# EasyEDA Pro project BULLBERRYCPP_REV1.0_2025-06-09.epro

# Schematic Schematic1
Board Name: Board1; Create Date: 2025-05-03; Page Name: P1; Project Name: STM32_RA02; Schematic Name: Schematic1; Update Date: 2025-06-09; Company: EasyEDA.com; Page Size: A4; Version: V1.0
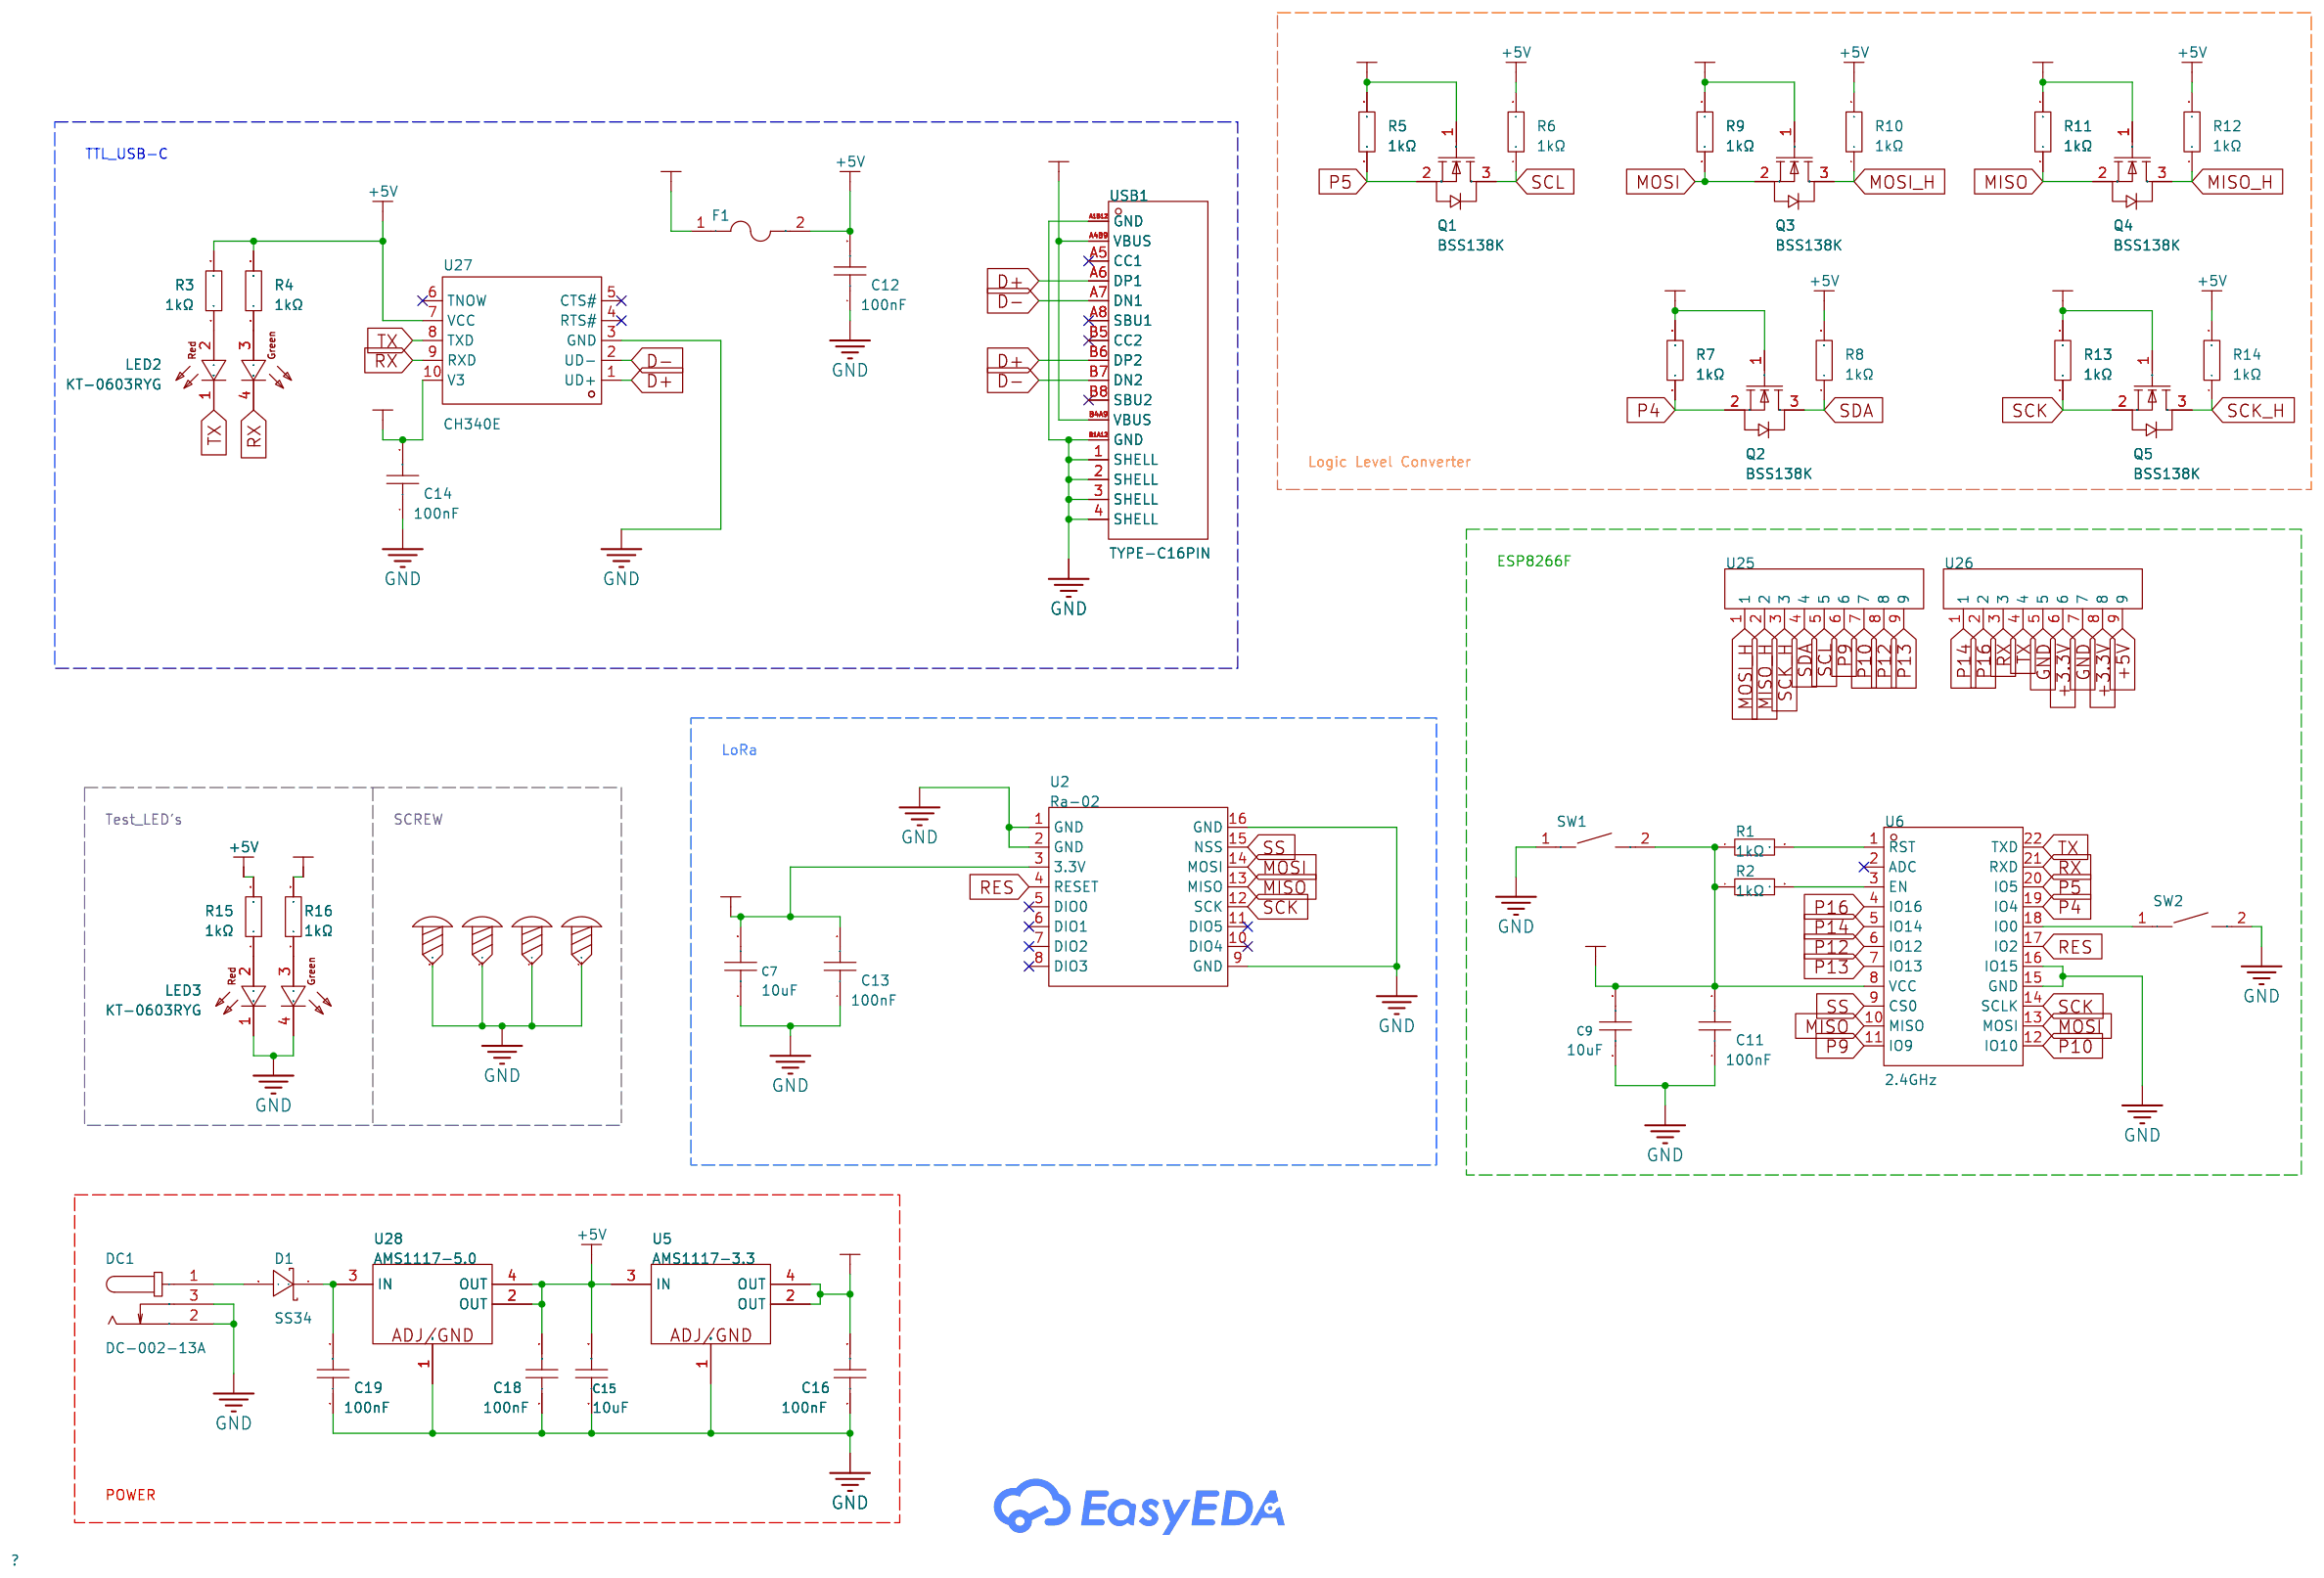
[diagram p0: schematic sheet]

## Parts
C7  10uF  [C0603]
C9  10uF  [C0603]
C11  100nF  [C0603]
C12  100nF  [C0603]
C13  100nF  [C0603]
C14  100nF  [C0603]
C15  10uF  [C0603]
C16  100nF  [C0603]
C18  100nF  [C0603]
C19  100nF  [C0603]
D1  SS34  [SMA_L4.3-W2.6-LS5.2-RD]
DC1  DC-002-13A  [DC-IN-TH_DC-002-13A]
F1  JFC0603-0500FS  [F0603]
LED2  KT-0603RYG  [LED-SMD_4P-L1.6-W1.5_KT-0603RG]
LED3  KT-0603RYG  [LED-SMD_4P-L1.6-W1.5_KT-0603RG]
Q1  BSS138K  [SOT-23-3_L2.9-W1.3-P0.95-LS2.4-BR]
Q2  BSS138K  [SOT-23-3_L2.9-W1.3-P0.95-LS2.4-BR]
Q3  BSS138K  [SOT-23-3_L2.9-W1.3-P0.95-LS2.4-BR]
Q4  BSS138K  [SOT-23-3_L2.9-W1.3-P0.95-LS2.4-BR]
Q5  BSS138K  [SOT-23-3_L2.9-W1.3-P0.95-LS2.4-BR]
R1  1kΩ  [R0603]
R2  1kΩ  [R0603]
R3  1kΩ  [R0603]
R4  1kΩ  [R0603]
R5  1kΩ  [R0603]
R6  1kΩ  [R0603]
R7  1kΩ  [R0603]
R8  1kΩ  [R0603]
R9  1kΩ  [R0603]
R10  1kΩ  [R0603]
R11  1kΩ  [R0603]
R12  1kΩ  [R0603]
R13  1kΩ  [R0603]
R14  1kΩ  [R0603]
R15  1kΩ  [R0603]
R16  1kΩ  [R0603]
SCREW1  -  [Screw-Hole-M2]
SCREW2  -  [Screw-Hole-M2]
SCREW3  -  [Screw-Hole-M2]
SCREW4  -  [Screw-Hole-M2]
SW1  TS-1088-AR02016  [SW-SMD_L3.9-W3.0-P4.45]
SW2  TS-1088-AR02016  [SW-SMD_L3.9-W3.0-P4.45]
U2  Ra-02  [WIRELM-SMD_RA-02-BL]
U5  AMS1117-3.3  [SOT-223-3_L6.4-W3.5-P2.30-LS7.0-BR]
U6  2.4GHz  [WIRELM-SMD_ESP-12F]
U25  DIP插件  [HDR-TH_9P-P2.00-V-F]
U26  DIP插件  [HDR-TH_9P-P2.00-V-F]
U27  CH340E  [MSOP-10_L3.0-W3.0-P0.50-LS5.0-BL]
U28  AMS1117-5.0  [SOT-223-3_L6.4-W3.5-P2.30-LS7.0-BR]
USB1  TYPE-C16PIN  [USB-C-SMD_TYPE-C16PIN]

## Library data of the parts
C7 C9 C15 = CL10A106MA8NRNC: Capacitance: Tolerance:±20% Tolerance:±20% Voltage Rated: Temperature Coefficient:; LCSC Part Name: 10uF ±20% 25V; Supplier Part: C96446; Manufacturer: SAMSUNG(三星); Supplier Footprint: 0603; Datasheet: https://atta.szlcsc.com/upload/public/pdf/source/20160218/1457707763339.pdf; Supplier: LCSC; Tolerance: ±20%
C11-C14 C16 C18 C19 = CC0603KRX7R9BB104: Capacitance:100nF Tolerance:±10% Tolerance:±10% Voltage Rating:50V Temperature Coefficient:X7R; LCSC Part Name: 100nF ±10% 50V; Supplier Part: C14663; Manufacturer: YAGEO(国巨); Supplier Footprint: 0603; JLCPCB Part Class: Basic Part; Datasheet: https://atta.szlcsc.com/upload/public/pdf/source/20180910/C282072_33301C7F631E79921B82A8DAC6BCC5B3.pdf; Supplier: LCSC; Tolerance: ±10%; Voltage Rating: 50V; Temperature Coefficient: X7R
D1 = SS34_C8678: Diode Configuration:Independent Type Forward Voltage (Vf@If):550mV@3A Reverse Voltage (Vr):40V Rectified Current:3A Reverse Leakage Current (Ir):500uA@40V; LCSC Part Name: 电压:40V 电流:3A; Supplier Part: C8678; Manufacturer: MDD(辰达半导体); Supplier Footprint: SMA(DO-214AC); JLCPCB Part Class: Basic Part; Datasheet: https://atta.szlcsc.com/upload/public/pdf/source/20240710/2118BB86FDDB2E0B294389AC1F3F65C8.pdf; Supplier: LCSC; Diode Configuration: Independent Type; Forward Voltage (Vf@If): 550mV@3A; Reverse Voltage (Vr): 40V; Rectified Current: 3A; Reverse Leakage Current (Ir): 500uA@40V
DC1 = DC-002-13A: Connector Type:DC Power Receptacle Mounting Style:Bend insert Inside Contact Diameter:1.3mm Outside Contact Diameter:4.2mm Current Rating (Max):500mA Voltage Rating (Max):30V Operating Temperature Range:-20℃~+70℃ Operating Temperature Range:-20℃~+70℃; LCSC Part Name: DC电源插座 内径:1.3mm 外径:4.2mm; Supplier Part: C707309; Manufacturer: 韩国韩荣; Supplier Footprint: 插件; JLCPCB Part Class: Extended Part; Datasheet: https://atta.szlcsc.com/upload/public/pdf/source/20210810/214B8B4432BF60379F9A852A170B0BF8.pdf; Supplier: LCSC; Connector Type: DC Power Receptacle; Mounting Style: Bend insert; Inside Contact Diameter: 1.3mm; Outside Contact Diameter: 4.2mm; Current Rating (Max): 500mA; Voltage Rating (Max): 30V; Operating Temperature Range: -20℃~+70℃
F1 = JFC0603-0500FS: Type:SMD Fuse Current Rating:500mA Voltage Rating (AC):- Voltage Rating (DC):32V Operating Temperature:-55℃~+125℃ Operating Temperature:-55℃~+125℃ Interrupt Rating:50A; LCSC Part Name: 贴片式保险丝; Supplier Part: C136327; Manufacturer: JDTfuse(集电通); Supplier Footprint: 0603; JLCPCB Part Class: Extended Part; Datasheet: https://atta.szlcsc.com/upload/public/pdf/source/20230515/811EFBDB78EA9425F730277E38B1B60D.pdf; Supplier: LCSC; Type: SMD Fuse; Current Rating: 500mA; Voltage Rating (DC): 32V; Operating Temperature: -55℃~+125℃; Interrupt Rating: 50A
LED2 LED3 = KT-0603RYG: LCSC Part Name: 0603 红普绿 双色; Supplier Part: C24477; Manufacturer: KENTO; Supplier Footprint: 0603x2; JLCPCB Part Class: Extended Part; Datasheet: https://atta.szlcsc.com/upload/public/pdf/source/20240614/A37E0302B47AC53F7ED7BF75B5175F81.pdf; Supplier: LCSC
Q1-Q5 = BSS138K_C18221542: Type:1 N-channel Drain to Source Voltage:50V Current - Continuous Drain(Id):- RDS(on):1.2Ω@10V,0.2A Pd - Power Dissipation:- Gate Threshold Voltage (Vgs(th)@Id):800mV Gate Charge(Qg):- Input Capacitance(Ciss@Vds):25.5pF@30V Reverse Transfer Capacitance (C; LCSC Part Name: 1个N沟道 耐压:50V 电流:500mA; Supplier Part: C18221542; Manufacturer: PAKER(派克微); Supplier Footprint: SOT-23; JLCPCB Part Class: Extended Part; Datasheet: https://atta.szlcsc.com/upload/public/pdf/source/20231012/5B919D1E52D9D928AB3BBCE981CA3146.pdf; Supplier: LCSC; Type: 1 N-channel; Drain to Source Voltage: 50V; RDS(on): 1.2Ω@10V,0.2A; Gate Threshold Voltage (Vgs(th)@Id): 800mV; Input Capacitance(Ciss@Vds): 25.5pF@30V; Operating Temperature: -55℃~+150℃
R1-R16 = 0603WAF1001T5E: Type:Thick Film Resistors Resistance:1kΩ Tolerance:±1% Tolerance:±1% Power(Watts): Overload Voltage (Max): Temperature Coefficient:±100ppm/℃ Temperature Coefficient:±100ppm/℃ Operating Temperature Range:-55℃~+155℃ Operating Temperature Range:-55℃~+155℃; LCSC Part Name: 1kΩ ±1% 100mW 厚膜电阻; Supplier Part: C21190; Manufacturer: UNI-ROYAL(厚声); Supplier Footprint: 0603; Datasheet: https://atta.szlcsc.com/upload/public/pdf/source/20200306/C422600_1E6D84923E4A46A82E41ADD87F860B5C.pdf; Supplier: LCSC; Type: Thick Film Resistors; Tolerance: ±1%; Temperature Coefficient: ±100ppm/℃; Operating Temperature Range: -55℃~+155℃
SCREW1-SCREW4 = Screw-Hole-M2: Supplier Footprint: 插件
SW1 SW2 = TS-1088-AR02016: Circuit:SPST Actuator Style:Round Button Operating Force:160gf Mounting Style:Brick nogging Switch Length:4mm Switch Width:3mm Switch Height:2mm Strike Gundam:不带 Contact Current:50mA Voltage Rating (DC):12V Insulation Resistance:100MΩ Actuator/Cap Color:B; LCSC Part Name: 4*3*2mm 立贴 轻触开关; Supplier Part: C720477; Manufacturer: XUNPU(讯普); Supplier Footprint: SMD; JLCPCB Part Class: Basic Part; Datasheet: https://atta.szlcsc.com/upload/public/pdf/source/20200810/C720475_60D09DD6C54279ADDB2DC25100F1CC11.pdf; Supplier: LCSC; Circuit: SPST; Actuator Style: Round Button; Operating Force: 160gf; Mounting Style: Brick nogging; Switch Length: 4mm; Switch Width: 3mm; Switch Height: 2mm; Strike Gundam: 不带; Contact Current: 50mA; Voltage Rating (DC): 12V; Insulation Resistance: 100MΩ; Actuator/Cap Color: Black; Pin Style: SMDSplicing; Mechanical Life: 10万次; Operating Temperature: -30℃~+80℃
U2 = Ra-02_C90039: Output Power:20dBm Output Power:20dBm Support Interface:SPI Modulation System:LoRa；OOK；MSK；GFSK；FSK；GMSK Operating Voltage:3.3V Operating Voltage:3.3V Antenna Type:IPEX Interface Receive  Current:12.15mA Send  Current:105mA Sensitivity:-140dBm Sensitivity; LCSC Part Name: 433MHz LORA扩频无线模块 超远10KM SX1278; Supplier Part: C90039; Manufacturer: Ai-Thinker(安信可); Supplier Footprint: SMD-16P; Datasheet: https://atta.szlcsc.com/upload/public/pdf/source/20181018/C90039_B5D7ADB38ADA1100C85850A55553934D.pdf; Supplier: LCSC; Output Power: 20dBm; Support Interface: SPI; Modulation System: LoRa；OOK；MSK；GFSK；FSK；GMSK; Operating Voltage: 3.3V; Antenna Type: IPEX Interface; Receive  Current: 12.15mA; Send  Current: 105mA; Sensitivity: -140dBm; Operating Temperature: -40℃~+85℃
U5 = AMS1117-3.3: Output Type:Fixed Voltage - Supply:15V Output Voltage:3.3V Output Voltage:3.3V Output Current:1A Power Supply Rejection Ratio (PSRR):- Features:Overcurrent Protection(OCP) Operating Temperature:-40℃~+125℃ Operating Temperature:-40℃~+125℃ Output Configurat; Supplier Part: C2992570; Manufacturer: 国芯佳品; Supplier Footprint: SOT-223-3; JLCPCB Part Class: Extended Part; Datasheet: https://atta.szlcsc.com/upload/public/pdf/source/20220729/0D21C21EC310E4778671BF6BAE438640.pdf; Supplier: LCSC; Output Type: Fixed; Voltage - Supply: 15V; Output Voltage: 3.3V; Output Current: 1A; Features: Overcurrent Protection(OCP); Operating Temperature: -40℃~+125℃; Output Configuration: Positive electrode; Number of Outputs: 1
U6 = ESP-12F: Wireless Standard:WIFI4 Interface Type:IO；UART Frequency:2.4GHz Antenna Type:PCB Output Power:15dBm Output Power:15dBm Voltage - Supply:3.3V Voltage - Supply:3.3V Receive  Current:55mA Send  Current:375mA Sensitivity:-96dBm Sensitivity:-96dBm Operating Te; LCSC Part Name: ESP8266 WiFi模组,32Mbit Flash, 通用模组; Supplier Part: C19949064; Manufacturer: DOIT(四博智联); Supplier Footprint: SMD,24x16mm; JLCPCB Part Class: Extended Part; Datasheet: https://atta.szlcsc.com/upload/public/pdf/source/20240112/4C731B83AC84B82D8ABE33233BB0FED4.pdf; Supplier: LCSC; Wireless Standard: WIFI4; Interface Type: IO；UART; Antenna Type: PCB; Output Power: 15dBm; Voltage - Supply: 3.3V; Receive  Current: 55mA; Send  Current: 375mA; Sensitivity: -96dBm; Operating Temperature: -40℃~+85℃
U25 U26 = DIP插件: Supplier Part: C9900022440; Supplier Footprint: HDR-TH-6P; JLCPCB Part Class: Extended Part; Supplier: LCSC
U27 = CH340E: Applications Function:Transceiver Protocol: Supply Voltage:3.3V；5V Supply Voltage:3.3V；5V Data Rate:2Mbps; LCSC Part Name: USB转串口芯片CH340; Supplier Part: C99652; Manufacturer: WCH(南京沁恒); Supplier Footprint: MSOP-10; Datasheet: https://atta.szlcsc.com/upload/public/pdf/source/20240313/4FD4567B6A986AE079C4960D6CEBDDB5.pdf; Supplier: LCSC; Applications Function: Transceiver; Supply Voltage: 3.3V；5V; Data Rate: 2Mbps
U28 = AMS1117-5.0: Output Type:Fixed Voltage - Supply:15V Output Voltage:5V Output Voltage:5V Output Current:1A Power Supply Rejection Ratio (PSRR):- Features:Overcurrent Protection(OCP) Operating Temperature:-40℃~+125℃ Operating Temperature:-40℃~+125℃ Output Configuration:; Supplier Part: C2992571; Manufacturer: 国芯佳品; Supplier Footprint: SOT-223-3; JLCPCB Part Class: Extended Part; Datasheet: https://atta.szlcsc.com/upload/public/pdf/source/20220729/0D21C21EC310E4778671BF6BAE438640.pdf; Supplier: LCSC; Output Type: Fixed; Voltage - Supply: 15V; Output Voltage: 5V; Output Current: 1A; Features: Overcurrent Protection(OCP); Operating Temperature: -40℃~+125℃; Output Configuration: Positive electrode; Number of Outputs: 1
USB1 = TYPE-C16PIN: Connector Type:Type-C Standard:USB 3.1 Gender:Female Mounting Style:Horizontal attachment Number of Contacts:16P Number of Ports:1 Current Rating - Power (Max):3A Operating Temperature Range:-40℃~+85℃ Operating Temperature Range:-40℃~+85℃ Rated Voltage (M; LCSC Part Name: Type-C 母 卧贴; Supplier Part: C393939; Manufacturer: SHOU HAN(首韩); Supplier Footprint: SMD; Datasheet: https://atta.szlcsc.com/upload/public/pdf/source/20190521/C393939_7B9043D4CF1026AF443AB60D91FBCD5C.pdf; Supplier: LCSC; Connector Type: Type-C; Standard: USB 3.1; Gender: Female; Mounting Style: Horizontal attachment; Number of Contacts: 16P; Number of Ports: 1; Current Rating - Power (Max): 3A; Operating Temperature Range: -40℃~+85℃; Rated Voltage (Max): 30V; Connect-Disconnect Life: 10,000 times; Core Colour: Black

## Nets
+3.3V: C7.2 C9.2 C11.2 C13.2 C14.2 C16.2 Q1.1(G) Q2.1(G) Q3.1(G) Q4.1(G) Q5.1(G) R1.1 R2.1 R5.2 R7.2 R9.2 R11.2 R13.2 R16.2 SW1.2 U2.3(3.3V) U5.2(OUT) U5.4(OUT) U6.8(VCC) U26.6 U26.8 U27.10(V3)
+5V: C12.2 C15.2 C18.2 F1.2 R3.2 R4.2 R6.2 R8.2 R10.2 R12.2 R14.2 R15.2 U5.3(IN) U26.9 U27.7(VCC) U28.2(OUT) U28.4(OUT)
GND: C7.1 C9.1 C11.1 C12.1 C13.1 C14.1 C15.1 C16.1 C18.1 C19.1 DC1.2 DC1.3 LED3.1(C) LED3.4(C) SCREW1.1 SCREW2.1 SCREW3.1 SCREW4.1 SW1.1 SW2.2 U2.1(GND) U2.2(GND) U2.9(GND) U2.16(GND) U5.1(ADJ/GND) U6.15(GND) U6.16(IO15) U26.5 U26.7 U27.3(GND) U28.1(ADJ/GND) USB1.1(SHELL) USB1.2(SHELL) USB1.3(SHELL) USB1.4(SHELL) USB1.A1B12(GND) USB1.B1A12(GND)
VBUS: F1.1 USB1.A4B9(VBUS) USB1.B4A9(VBUS)
D+: U27.1(UD+) USB1.A6(DP1) USB1.B6(DP2)
D-: U27.2(UD-) USB1.A7(DN1) USB1.B7(DN2)
MISO: Q4.2(S) R11.1 U2.13(MISO) U6.10(MISO)
MISO_H: Q4.3(D) R12.1 U25.2
MOSI: Q3.2(S) R9.1 U2.14(MOSI) U6.13(MOSI)
MOSI_H: Q3.3(D) R10.1 U25.1
P4: Q2.2(S) R7.1 U6.19(IO4)
P5: Q1.2(S) R5.1 U6.20(IO5)
P9: U6.11(IO9) U25.6
P10: U6.12(IO10) U25.7
P12: U6.6(IO12) U25.8
P13: U6.7(IO13) U25.9
P14: U6.5(IO14) U26.1
P16: U6.4(IO16) U26.2
RES: U2.4(RESET) U6.17(IO2)
RX: LED2.4(C) U6.21(RXD) U26.3 U27.9(RXD)
SCK: Q5.2(S) R13.1 U2.12(SCK) U6.14(SCLK)
SCK_H: Q5.3(D) R14.1 U25.3
SCL: Q1.3(D) R6.1 U25.5
SDA: Q2.3(D) R8.1 U25.4
SS: U2.15(NSS) U6.9(CS0)
TX: LED2.1(C) U6.22(TXD) U26.4 U27.8(TXD)
$1N5142: R2.2 U6.3(EN)
$1N5147: R1.2 U6.1(RST)
$1N5632: SW2.1 U6.18(IO0)
$1N9518: LED2.2(A) R3.1
$1N9520: LED2.3(A) R4.1
$1N11147: C19.2 D1.1(K) U28.3(IN)
$1N12736: LED3.2(A) R15.1
$1N12778: LED3.3(A) R16.1
$1N14428: D1.2(A) DC1.1

Not connected (* = marked no-connect by the designer): U2 5(DIO0)* 6(DIO1)* 7(DIO2)* 8(DIO3)* 10(DIO4)* 11(DIO5)*; U6 2(ADC)*; U27 4(RTS#)* 5(CTS#)* 6(TNOW)*; USB1 A5(CC1)* A8(SBU1)* B5(CC2)* B8(SBU2)*

## Notes on the sheet
- TTL_USB-C
- Logic Level Converter
- ESP8266F
- LoRa
- Test_LED's
- SCREW
- POWER

# Board PCB1
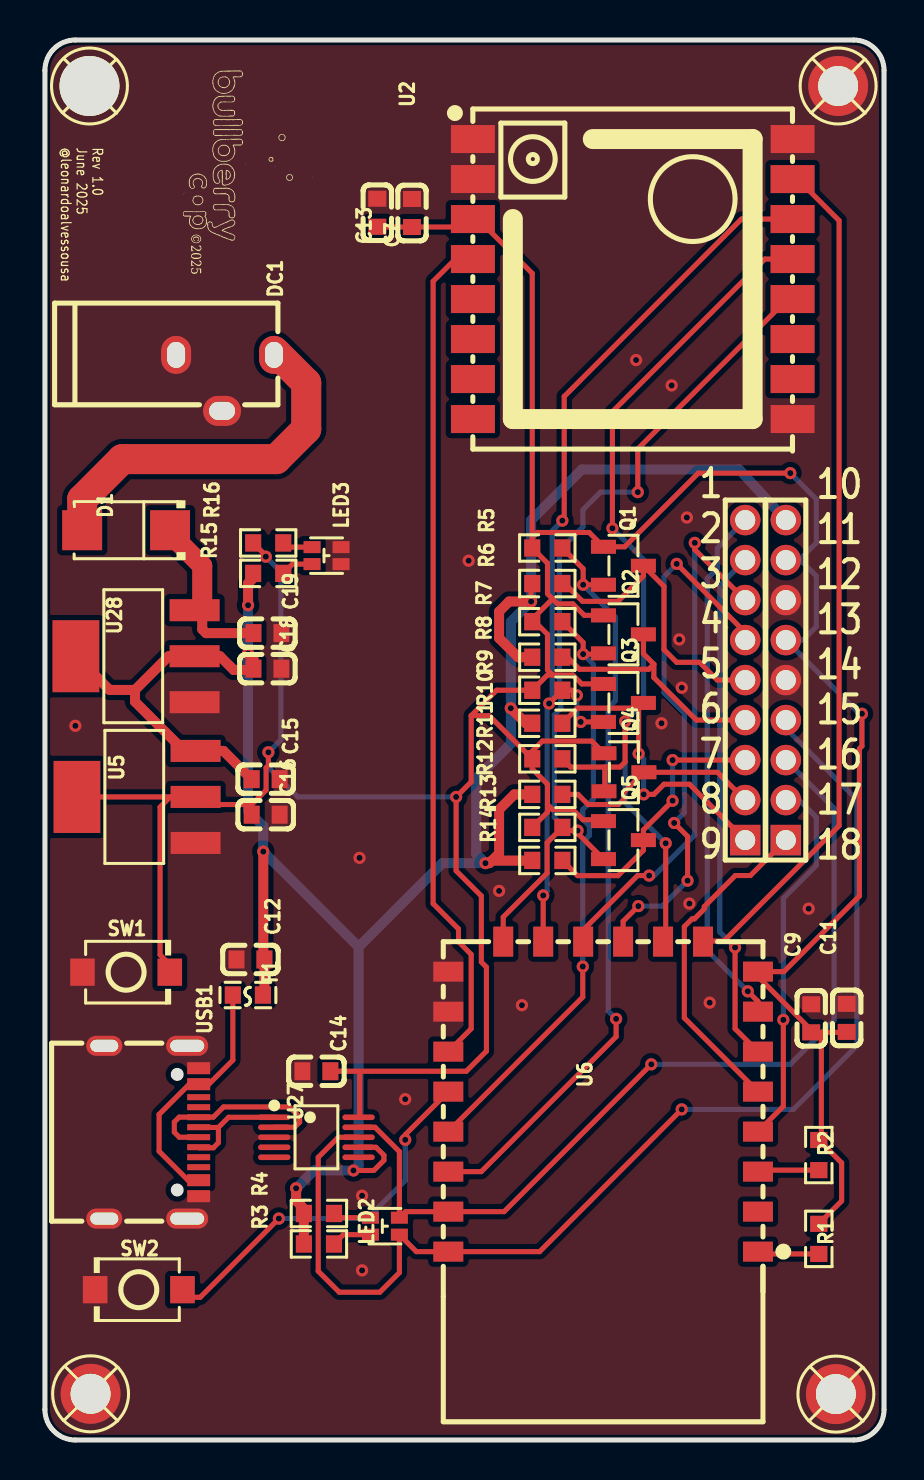
[diagram p1: board, top side]
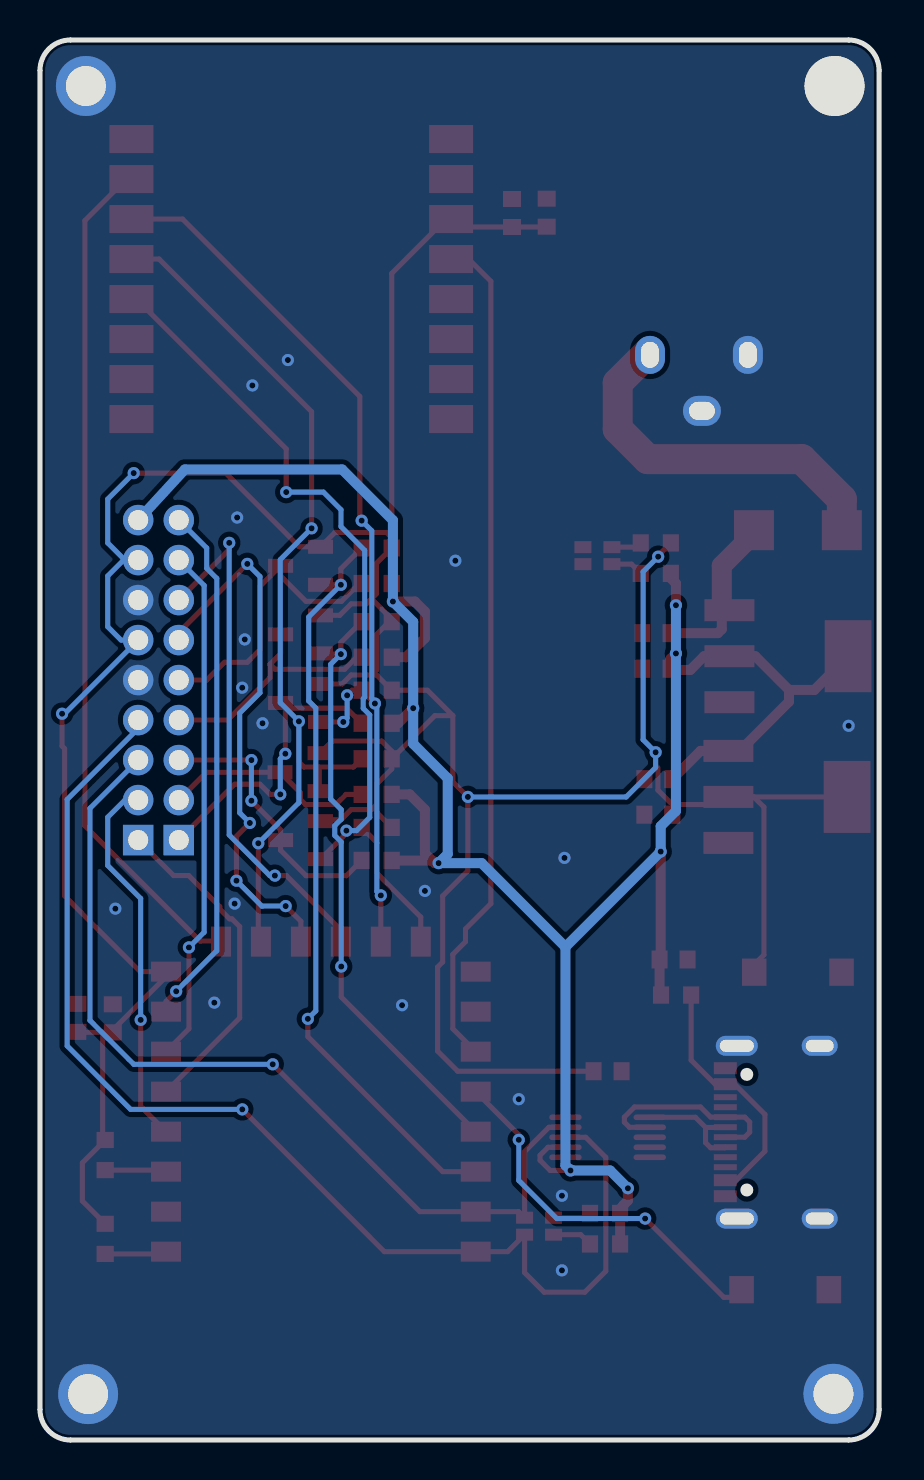
[diagram p2: board, bottom side, seen from below]

Outline 42 x 70 mm; copper layers: Top Layer, Bottom Layer. Coordinates in mm from the lower left corner of the outline.
Outline path: 0,68.48 0,1.52 arc(0.45,0.45) 1.52,0 40.48,0 arc(41.55,0.45) 42,1.52 42,68.48 arc(41.55,69.55) 40.48,70 1.52,70 arc(0.45,69.55) 0,68.48
Stack: Top Layer 0.035mm / Dielectric1 1.51mm FR4 er 4.5 / Bottom Layer 0.035mm

## Design rules (mm)
template: JLCPCB Capability(Two Layers Board)
spacing copperThickness1oz (default): track to track 0.102, other pairs 0.152 to 0.3
spacing copperThickness2oz: track to track 0.203, other pairs 0.152 to 0.3
track width copperThickness1oz (default): min 0.127, default 0.254, max 2.54
track width copperThickness2oz: min 0.203, default 0.254, max 2.54
differential pair differentialPair (default): width min 0.127, default 0.254, max 2.54; gap min 0.152, default 0.152
via viaSize (default): diameter min 0.5, default 0.61, max 10; hole min 0.3, default 0.305, max 6.3

## Placement (name value [footprint] x y rotation side)
C7  10uF  [C0603]  18.37 61.35 270 top
C9  10uF  [C0603]  38.36 21.08 270 top
C11  100nF  [C0603]  40.13 21.11 270 top
C12  100nF  [C0603]  10.29 24.03 0 top
C13  100nF  [C0603]  16.64 61.36 270 top
C14  100nF  [C0603]  13.59 18.44 0 top
C15  10uF  [C0603]  11.05 33.04 180 top
C16  100nF  [C0603]  11.05 31.27 180 top
C18  100nF  [C0603]  11.14 38.57 180 top
C19  100nF  [C0603]  11.14 40.34 180 top
D1  SS34  [SMA_L4.3-W2.6-LS5.2-RD]  4.06 45.49 180 top
DC1  DC-002-13A  [DC-IN-TH_DC-002-13A]  9.02 52.86 0 top
F1  JFC0603-0500FS  [F0603]  10.16 22.25 0 top
LED2  KT-0603RYG  [LED-SMD_4P-L1.6-W1.5_KT-0603RG]  17.02 10.69 180 top
LED3  KT-0603RYG  [LED-SMD_4P-L1.6-W1.5_KT-0603RG]  14.1 44.22 180 top
Q1  BSS138K  [SOT-23-3_L2.9-W1.3-P0.95-LS2.4-BR]  28.96 43.71 180 top
Q2  BSS138K  [SOT-23-3_L2.9-W1.3-P0.95-LS2.4-BR]  28.96 40.28 180 top
Q3  BSS138K  [SOT-23-3_L2.9-W1.3-P0.95-LS2.4-BR]  28.96 36.85 180 top
Q4  BSS138K  [SOT-23-3_L2.9-W1.3-P0.95-LS2.4-BR]  28.98 33.39 180 top
Q5  BSS138K  [SOT-23-3_L2.9-W1.3-P0.95-LS2.4-BR]  28.96 30 180 top
R1  1kΩ  [R0603]  38.74 10.06 270 top
R2  1kΩ  [R0603]  38.74 14.25 270 top
R3  1kΩ  [R0603]  13.72 9.8 180 top
R4  1kΩ  [R0603]  13.72 11.33 180 top
R5  1kΩ  [R0603]  25.15 44.6 180 top
R6  1kΩ  [R0603]  25.15 42.82 180 top
R7  1kΩ  [R0603]  25.15 40.92 180 top
R8  1kΩ  [R0603]  25.15 39.14 180 top
R9  1kΩ  [R0603]  25.15 37.49 180 top
R10  1kΩ  [R0603]  25.15 35.84 180 top
R11  1kΩ  [R0603]  25.15 34.06 180 top
R12  1kΩ  [R0603]  25.15 32.28 180 top
R13  1kΩ  [R0603]  25.15 30.63 180 top
R14  1kΩ  [R0603]  25.15 28.98 180 top
R15  1kΩ  [R0603]  11.18 43.33 180 top
R16  1kΩ  [R0603]  11.18 44.85 180 top
SCREW1  -  [Screw-Hole-M2#2]  2.23 67.7 0 top
SCREW2  -  [Screw-Hole-M2]  39.7 67.7 0 top
SCREW3  -  [Screw-Hole-M2]  2.29 2.31 0 top
SCREW4  -  [Screw-Hole-M2]  39.59 2.29 0 top
SW1  TS-1088-AR02016  [SW-SMD_L3.9-W3.0-P4.45]  4.06 23.39 0 top
SW2  TS-1088-AR02016  [SW-SMD_L3.9-W3.0-P4.45]  4.7 7.52 180 top
U2  Ra-02  [WIRELM-SMD_RA-02-BL]  29.42 58.05 270 top
U5  AMS1117-3.3  [SOT-223-3_L6.4-W3.5-P2.30-LS7.0-BR]  4.57 32.15 0 top
U6  2.4GHz  [WIRELM-SMD_ESP-12F]  27.94 17.17 180 top
U25  DIP插件  [HDR-TH_9P-P2.00-V-F]  35.05 38 90 top
U26  DIP插件  [HDR-TH_9P-P2.00-V-F]  37.08 38 90 top
U27  CH340E  [MSOP-10_L3.0-W3.0-P0.50-LS5.0-BL]  13.59 15.14 270 top
U28  AMS1117-5.0  [SOT-223-3_L6.4-W3.5-P2.30-LS7.0-BR]  4.52 39.19 0 top
USB1  TYPE-C16PIN  [USB-C-SMD_TYPE-C16PIN]  5.33 15.39 270 top

## Footprints (pads in the part's own frame, mm; a bottom-side part is the same pattern mirrored in y, then rotated)
C0603
  rect 0.8x0.9 smd: 1(-0.7,0) 2(0.7,0)
DC-IN-TH_DC-002-13A
  oval 1.5x1.9 hole 0.9x1.3: 1(2.45,1.4) 2(-2.45,1.4)
  oval 1.9x1.5 hole 1.3x0.9: 3(-0.15,-1.4)
F0603
  rect 0.806x0.864 smd: 1(-0.753,0) 2(0.753,0)
HDR-TH_9P-P2.00-V-F
  rect 1.524x1.524 hole 1: 1(-8,0)
  round 1.524 hole 1: 2(-6,0) 3(-4,0) 4(-2,0) 5(0,0) 6(2,0) 7(4,0) 8(6,0) 9(8,0)
LED-SMD_4P-L1.6-W1.5_KT-0603RG
  rect 0.85x0.6 smd: 1(-0.725,0.425) 2(0.725,0.425) 3(0.725,-0.425) 4(-0.725,-0.425)
MSOP-10_L3.0-W3.0-P0.50-LS5.0-BL
  oval 0.28x1.62 smd: 1(-1,-2.11) 2(-0.5,-2.11) 3(0,-2.11) 4(0.5,-2.11) 5(1,-2.11) 6(1,2.11) 7(0.5,2.11) 8(0,2.11) 9(-0.5,2.11) 10(-1,2.11)
R0603
  rect 0.806x0.864 smd: 1(-0.753,0) 2(0.753,0)
Screw-Hole-M2
  round 3 hole 2: 1(0,0)
Screw-Hole-M2#2
  round 3 hole 6x2: 1(0,0)
SMA_L4.3-W2.6-LS5.2-RD
  rect 2x2 smd: 1(-2.2,0) 2(2.2,0)
SOT-23-3_L2.9-W1.3-P0.95-LS2.4-BR
  rect 1.25x0.7 smd: 1(1,-0.95) 2(1,0.95) 3(-1,0)
SOT-223-3_L6.4-W3.5-P2.30-LS7.0-BR
  rect 2.5x1.1 smd: 1(2.97,-2.3) 2(2.97,0) 3(2.97,2.3)
  rect 2.34x3.6 smd: 4(-2.97,0)
SW-SMD_L3.9-W3.0-P4.45
  rect 1.23x1.36 smd: 1(-2.185,0) 2(2.185,0)
USB-C-SMD_TYPE-C16PIN
  oval 1x2.1 hole 0.6x1.7: 1(-4.32,1.788) 2(4.32,1.788)
  oval 1x1.8 hole 0.6x1.4: 3(-4.32,-2.362) 4(4.32,-2.362)
  rect 0.6x1.15 smd: A1B12(-3.2,2.362) A4B9(-2.4,2.362) B1A12(3.2,2.362) B4A9(2.4,2.362)
  rect 0.3x1.15 smd: A5(-1.25,2.362) A6(-0.25,2.362) A7(0.25,2.362) A8(1.25,2.362) B5(1.75,2.362) B6(0.75,2.362) B7(-0.75,2.362) B8(-1.75,2.362)
WIRELM-SMD_ESP-12F
  rect 1.5x1 smd: 1(-7.75,7.75) 2(-7.75,5.75) 3(-7.75,3.75) 4(-7.75,1.75) 5(-7.75,-0.25) 6(-7.75,-2.25) 7(-7.75,-4.25) 8(-7.75,-6.25) 15(7.75,-6.25) 16(7.75,-4.25) 17(7.75,-2.25) 18(7.75,-0.25) 19(7.75,1.75) 20(7.75,3.75) 21(7.75,5.75) 22(7.75,7.75)
  rect 1x1.5 smd: 9(-5,-7.75) 10(-3,-7.75) 11(-1,-7.75) 12(1,-7.75) 13(3,-7.75) 14(5,-7.75)
WIRELM-SMD_RA-02-BL
  rect 1.4x2.2 smd: 1(-7,-8) 2(-5,-8) 3(-3,-8) 4(-1,-8) 5(1,-8) 6(3,-8) 7(5,-8) 8(7,-8) 9(7,8) 10(5,8) 11(3,8) 12(1,8) 13(-1,8) 14(-3,8) 15(-4.998,8) 16(-7,8)

## Nets
As in the schematic.

Pads without a net: U2 5 6 7 8 10 11; U6 2; U27 4 5 6; USB1 A5 A8 B5 B8

## Via types
v1: diameter 0.61, hole 0.305, Top Layer to Bottom Layer, 61 vias

## Routing (per net, layer and track width the routed paths; a pad name or vN(x,y) marks a point on that pad's centre or on a via; arc(x,y) is an arc through that point)
+3.3V: length 192.1
  Top Layer w0.254: v1(40.89,36.31) 40.89,34.69 40.77,34.57 40.77,27.2 36.98,23.42 U6.8 35.69,23.16 38.36,20.5 C9.2 38.86,20.38 ; 6.27,32.15 U5.4 ; 6.27,32.15 5.76,31.65 5.76,24.26 6.25,23.77 ; 6.27,32.15 U5.2 7.92,31.77 10.35,31.77 ; 25.15,31.77 25.41,31.52 26.42,31.52 26.93,31.01 27.89,31.01 Q5.1 ; 25.15,31.77 25.15,31.39 R13.2 ; 25.15,31.77 25.15,32.79 24.39,33.55 R11.2 ; 38.86,20.38 40.11,20.38 C11.2 ; 38.86,20.38 38.86,15.13 R2.1 39.88,13.86 39.88,11.95 R1.1 ; v1(11.18,34.39) 11.18,33.72 11.07,33.61 11.07,32.49 10.35,31.77 ; v1(37.31,48.34) 32.7,48.34 29.02,44.66 Q1.1 27.24,45.38 24.65,45.38 24.39,45.12 ; R11.2 24.39,34.44 24.9,34.95 27.37,34.95 Q4.1 ; R11.2 22.23,36.22 21.34,36.22 ; 10.35,31.77 C16.2 ; 24.39,45.12 R5.2 25.15,43.84 25.15,42.31 25.41,42.06 ; 24.39,45.12 24.39,58.33 21.68,61.05 U2.3 21.02,60.65 C7.2 16.65,60.65 C13.2 ; 21.34,36.22 21.34,32.91 v1(20.58,32.15) 20.58,28.46 21.84,27.2 21.84,23.9 22.1,23.64 22.1,19.45 21.09,18.44 15.76,18.44 ; 21.34,36.22 22.61,37.49 R9.2 25.15,38.25 25.41,38.25 ; U27.10 15.76,16.19 15.76,18.44 ; v1(11.06,44.17) 11.06,44.22 R16.2 ; Q2.1 27,41.23 26.42,41.81 25.66,41.81 25.41,42.06 ; 15.76,18.44 14.29,18.44 ; 24.39,41.04 R7.2 ; 24.39,41.04 25.41,42.06 ; 24.39,41.04 25.15,40.28 25.15,38.5 25.41,38.25 ; 25.41,38.25 26.42,38.25 26.87,37.8 Q3.1
  Bottom Layer w0.254: U26.8 37.75,44 ; 37.75,44 38.61,44.85 38.61,47.04 v1(37.31,48.34) ; 37.75,44 37.81,44 38.61,43.2 38.61,40.66 37.94,40 U26.6 40.77,36.31 v1(40.89,36.31) ; v1(20.58,32.15) 12.66,32.15 11.18,33.62 v1(11.18,34.39) 11.81,35.01 11.81,43.41 v1(11.06,44.17)
+5V: length 123.9
  Top Layer w0.254: U27.7 16.57,14.64 16.97,14.24 16.97,13.98 16.46,13.48 v1(15.44,13.48) ; R6.2 24.34,42.76 v1(24.34,41.92)
  Top Layer w0.5: v1(12.57,12.59) 12.57,11.97 12.8,11.75 12.8,11.73 13.08,11.44 ; v1(10.17,41.74) 10.17,42.83 10.42,43.08 ; v1(23.32,36.59) 24.07,35.84 R10.2 ; 22.37,28.97 24.38,28.97 R14.2 ; 22.37,28.97 22.25,28.84 v1(22.05,28.84) ; 22.37,28.97 22.73,29.33 22.73,31.52 23.5,32.28 R12.2 ; C12.2 10.99,22.32 ; R4.2 R3.2 ; U28.4 3.24,37.5 4.51,37.5 ; 4.51,37.5 6.2,39.19 U28.2 8.76,39.19 9.45,38.5 10.11,38.5 ; 4.51,37.5 4.51,36.92 6.97,34.45 8.94,34.45 C15.2 ; v1(10.93,29.42) 10.93,24.08 ; R8.2 23.69,39.14 22.73,40.09 22.73,41.42 23.23,41.92 v1(24.34,41.92) ; v1(10.17,39.33) 10.44,39.06 C18.2
  Bottom Layer w0.5: v1(10.17,41.74) v1(10.17,39.33) 10.17,31.45 10.93,30.69 v1(10.93,29.42) 15.7,24.65 ; 15.7,24.65 19.89,28.84 v1(22.05,28.84) 21.59,29.3 21.59,33.08 23.32,34.81 v1(23.32,36.59) 23.32,40.91 v1(24.34,41.92) 24.34,45.99 26.88,48.53 34.75,48.53 U26.9 ; 15.7,24.65 15.7,13.73 v1(15.44,13.48) 13.46,13.48 v1(12.57,12.59)
GND:
  vias: v1(1.52,35.71) v1(15.75,29.11) v1(15.88,12.22) v1(15.88,8.48) v1(18.03,17.04) v1(21.21,43.97) v1(22.73,27.45) v1(23.88,21.74) v1(29.59,54) v1(30.86,35.84) v1(31.37,52.73) v1(31.75,40.03) v1(31.88,37.61) v1(32.13,46.12) v1(32.26,26.82) v1(33.27,21.87) v1(38.23,26.57)
VBUS: length 12.5
  Top Layer w0.254: F1.1 9.41,18.99 8.2,17.79 USB1.A4B9 7.23,17.79 5.72,16.28 5.72,14.44 7.16,12.99 USB1.B4A9
D+: length 5.9
  Top Layer w0.254: USB1.B6 7.72,14.61 8.43,14.61 8.69,14.87 8.69,15.63 ; 8.69,15.63 7.71,15.63 USB1.A6 ; 8.69,15.63 9.19,16.14 U27.1
D-: length 10.3
  Top Layer w0.254: U27.2 12.5,15.64 12.75,15.89 12.75,16.14 12.24,16.65 8.94,16.65 8.43,16.14 6.72,16.14 6.48,15.9 6.48,15.39 6.73,15.14 USB1.A7
MISO: length 47.3
  Top Layer w0.254: U6.10 31.07,25.05 v1(31.07,29.84) ; v1(28.41,45.59) 28.41,51.42 36.04,59.05 U2.13 ; 28.02,33.65 28.79,33.65 29.04,33.9 v1(29.04,35.93) ; 28.02,33.65 28.02,32.48 Q4.2 ; 28.02,33.65 26.31,33.65 R11.1
  Bottom Layer w0.254: v1(28.41,45.59) 29.97,44.02 29.97,36.86 v1(29.04,35.93) 29.04,31.87 v1(31.07,29.84)
MISO_H: length 10.8
  Top Layer w0.254: U25.2 33.66,33.39 Q4.3 28.97,32.37 28.97,32.03 28.71,31.77 27.19,31.77 26.68,32.28 R12.1
MOSI: length 47.2
  Top Layer w0.254: v1(25.24,36.82) R9.1 26.37,37.49 v1(26.62,37.23) ; v1(24.94,27.23) U6.13 ; U2.14 34.86,61.05 25.99,52.18 25.99,46.06 v1(25.9,45.97) ; v1(26.82,35.9) Q3.2
  Bottom Layer w0.254: v1(26.82,35.9) 26.62,36.1 v1(26.62,37.23) ; 25.14,36.82 25.14,27.43 v1(24.94,27.23) ; 25.14,36.82 v1(25.24,36.82) ; 25.14,36.82 25.39,37.08 25.39,45.46 v1(25.9,45.97)
MOSI_H: length 15.4
  Top Layer w0.254: U25.1 32.26,32.79 30.99,32.79 30.48,32.28 v1(29.97,32.28) ; v1(29.72,34.31) 29.72,36.61 ; 29.72,36.61 29.69,36.59 26.65,36.59 R10.1 ; 29.72,36.61 Q3.3
  Bottom Layer w0.254: v1(29.97,32.28) 29.97,34.06 v1(29.72,34.31)
P4: length 30.4
  Top Layer w0.254: v1(26.92,23.67) 26.92,22.15 U6.19 ; Q2.2 27.92,39.29 v1(26.94,39.29) 26.94,39.88 R7.1
  Bottom Layer w0.254: v1(26.92,23.67) 26.92,29.9 27.25,30.23 27.25,30.71 26.92,31.04 26.92,31.52 27.45,32.04 27.45,38.79 v1(26.94,39.29)
P5: length 38.1
  Top Layer w0.254: U6.20 21.84,13.42 28.59,20.17 v1(28.59,21.06) ; R5.1 26.94,43.56 v1(26.94,42.76) Q1.2
  Bottom Layer w0.254: v1(26.94,42.76) 28.55,41.15 28.55,36.95 28.19,36.6 28.19,21.45 v1(28.59,21.06)
P9: length 27.3
  Top Layer w0.254: U25.6 35.05,40.38 v1(31.62,43.81) ; v1(29.7,26.7) 28.94,25.93 U6.11 ; v1(32.17,27.97) 32.17,30.18 v1(31.5,30.85)
  Bottom Layer w0.254: v1(31.62,43.81) 30.99,43.17 30.99,37.36 32,36.34 32,31.36 v1(31.5,30.85) ; v1(32.17,27.97) 30.9,26.7 v1(29.7,26.7)
P10: length 26.6
  Top Layer w0.254: U25.7 32.53,44.52 v1(32.53,44.86) ; U6.12 26.94,25.5 29.66,28.22 v1(30.24,28.22)
  Bottom Layer w0.254: v1(32.53,44.86) 32.53,30.25 30.5,28.22 v1(30.24,28.22)
P12: length 25.9
  Top Layer w0.254: v1(34.54,24.63) 34.54,20.56 U6.6
  Bottom Layer w0.254: v1(34.54,24.63) 33.78,25.39 33.78,42.73 U25.8
P13: length 26.4
  Top Layer w0.254: U6.7 35.69,21.93 v1(35.18,22.43)
  Bottom Layer w0.254: v1(35.18,22.43) 33.15,24.47 33.15,43.08 33.66,43.58 33.66,44.6 U25.9
P14: length 16.7
  Top Layer w0.254: U26.1 35.31,28.22 34.56,28.22 33,26.67 33,26.55 32.51,26.06 32.39,26.06 32,25.67 32,21.1 U6.5
P16: length 18.8
  Top Layer w0.254: v1(36.96,21.01) 36.96,16.69 U6.4
  Bottom Layer w0.254: v1(36.96,21.01) 36.96,27.08 38.61,28.72 38.61,31.14 37.75,32 U26.2
RES: length 42.2
  Top Layer w0.254: U6.17 21.34,20.56 21.34,24.28 20.7,24.92 20.7,25.55 19.43,26.82 19.43,57.94 20.54,59.05 U2.4
RX: length 45.7
  Top Layer w0.254: v1(30.35,18.78) 22.98,11.42 U6.21 18.05,11.42 LED2.4 17.74,14.42 16.53,15.64 U27.9
  Bottom Layer w0.254: v1(30.35,18.78) 37.3,18.78 39.5,20.98 39.5,31.58 U26.3
SCK: length 43.1
  Top Layer w0.254: U6.14 22.94,26.15 25.14,28.34 25.14,29.87 R13.1 ; v1(29.68,47.39) 29.68,49.55 37.17,57.05 U2.12 ; 26.06,30.47 v1(26.66,30.47) 26.66,30.34 Q5.2
  Bottom Layer w0.254: v1(26.66,30.47) 26.15,30.47 25.49,31.13 25.49,36.26 25.82,36.58 25.82,37.07 25.75,37.14 25.75,44.48 26.93,45.67 26.93,46.51 27.81,47.39 v1(29.68,47.39)
SCK_H: length 13.6
  Top Layer w0.254: R14.1 26.66,28.22 28.69,28.22 29.96,29.49 Q5.3 29.96,30.5 v1(31.42,31.96) ; U25.3 v1(31.42,34)
  Bottom Layer w0.254: v1(31.42,34) v1(31.42,31.96)
SCL: length 14.8
  Top Layer w0.254: R6.1 26.02,42.82 26.91,41.93 28.69,41.93 29.96,43.2 Q1.3 30.99,42.68 30.99,39.52 31.62,38.89 32.77,38.89 33.66,38 U25.5
SDA: length 12.8
  Top Layer w0.254: 30.48,38.79 29.96,39.31 Q2.3 ; 30.48,38.79 30.48,38.12 32.61,36 U25.4 ; 30.48,38.79 30.23,38.54 26.76,38.54 26.15,39.14 R8.1
SS: length 42.7
  Top Layer w0.254: U2.15 37.68,63.05 39.75,60.97 39.75,30.71 33.98,24.95 32.97,24.95 U6.9
TX: length 60.2
  Top Layer w0.254: U27.8 14.68,15.14 13.68,14.13 13.68,8.44 14.73,7.39 16.76,7.39 17.74,8.37 LED2.1 18.59,9.42 U6.22 24.76,9.42 v1(31.87,16.53)
  Bottom Layer w0.254: v1(31.87,16.53) 37.46,16.53 40.64,19.71 40.64,32.02 37.08,35.58 U26.4
$1N5142: length 3.1
  Top Layer w0.254: U6.3 35.77,13.49 R2.2
$1N5147: length 3.1
  Top Layer w0.254: U6.1 35.81,9.3 R1.2
$1N5632: length 19.3
  Top Layer w0.254: v1(18.03,15.01) 18.03,15.26 U6.18 ; 6.5,7.13 7.77,7.13 v1(11.71,11.07)
  Bottom Layer w0.254: v1(18.03,15.01) 18.03,12.98 16.13,11.07 v1(11.71,11.07)
$1N9518: length 2
  Top Layer w0.254: R3.1 14.93,10.27 LED2.2
$1N9520: length 1.9
  Top Layer w0.254: R4.1 14.68,11.12 LED2.3
$1N11147: length 7.1
  Top Layer w0.5: 7.87,40.92 7.87,40.54 8.07,40.34 C19.2
  Top Layer w1: 7.87,41.87 7.87,43.71 6.26,45.32
$1N12736: length 1.6
  Top Layer w0.254: LED3.2 12.39,43.79 R15.1
$1N12778: length 1.5
  Top Layer w0.254: LED3.3 12.14,44.64 R16.1
$1N14428: length 18.6
  Top Layer w1.5: D1.2 1.86,47.04 3.87,49.05 11.58,49.05 13.08,50.55 13.08,52.86 11.59,54.34

## Copper pours and planes (outline as drawn; the poured copper is in the pictures)
GND on Top Layer: -3.68,74.45 46.23,74.45 46.23,-5.06 -3.68,-5.06
GND on Bottom Layer: -8,78.13 51.31,78.13 51.31,-8.23 -8,-8.23

## Text on the board
Top Silkscreen Layer: Rev 1.0 / June 2025 / @leonardoalvessousa | 1 / 2 / 3 / 4 / 5 / 6 / 7 / 8 / 9 | 10 / 11 / 12 / 13 / 14 / 15 / 16 / 17 / 18 | ©2025
